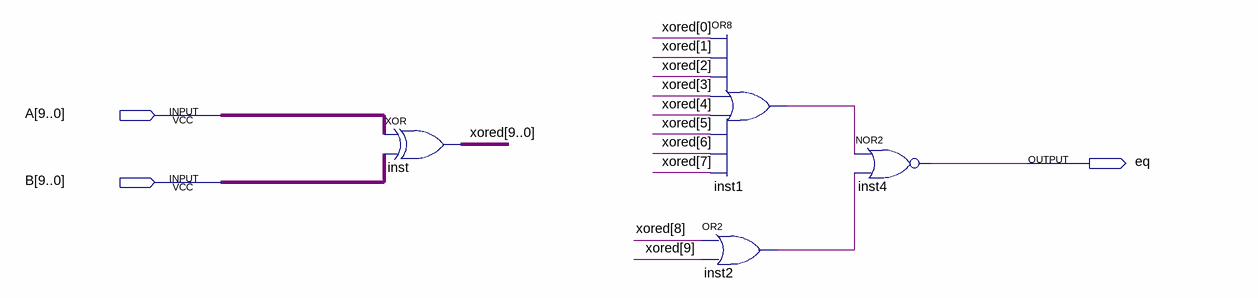
[diagram p0: schematic sheet]
// Quartus schematic cmp10_eq.bdf as structural Verilog: 4 symbols, 3 pins
module cmp10_eq (
  input  [9:0] A,
  input  [9:0] B,
  output eq
);

  wire inst1_out, inst2_out;
  wire [9:0] xored;

  assign xored = A ^ B;  // XOR inst, 10 bits wide
  or inst1 (inst1_out, xored[0], xored[1], xored[2], xored[3], xored[4], xored[5], xored[6], xored[7]);
  or inst2 (inst2_out, xored[8], xored[9]);
  nor inst4 (eq, inst1_out, inst2_out);
endmodule
